# EAGLE schematic evlogger_voltage (EAGLE 6.5.0)
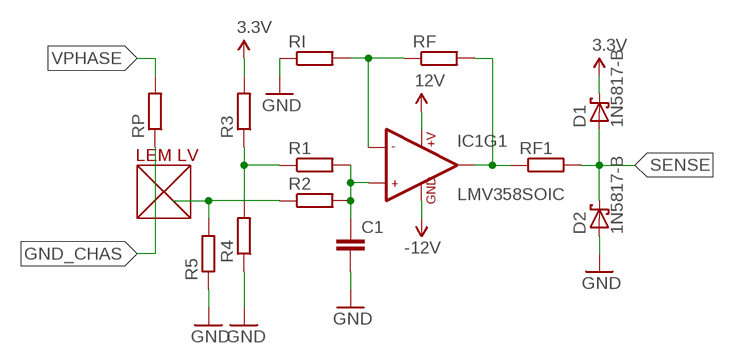
[diagram p0: schematic, sheet 1]

## Parts
C1  C-EU025-024X044  [C025-024X044]
D1  1N5817-B  [DO41-7.6]
D2  1N5817-B  [DO41-7.6]
IC1  LMV358SOIC  [SO08]
R1  R-EU_0207/10  [0207/10]
R2  R-EU_0207/10  [0207/10]
R3  R-EU_0207/10  [0207/10]
R4  R-EU_0207/10  [0207/10]
R5  R-EU_0207/10  [0207/10]
RF  R-EU_0207/10  [0207/10]
RF1  R-EU_0207/10  [0207/10]
RI  R-EU_0207/10  [0207/10]
RP  R-EU_0207/10  [0207/10]

## Nets
3.3V: D1.C R3.2
GND: C1.2 D2.A R4.1 R5.1 RI.1
GND_CHAS: RP.1
N$2: IC1.2(-IN1) RF.1 RI.2
N$4: C1.1 IC1.3(+IN1) R1.2 R2.2
N$5: R1.1 R3.1 R4.2
N$6: R2.1 R5.2
SENS: IC1.1(OUT1) RF1.1 RF.2
SENSE: D1.A D2.C RF1.2
VCC: IC1.8(+V) ; supply symbol labelled 12V
VNEG: IC1.4(GND) ; supply symbol labelled -12V
VPHASE: RP.2
Unconnected: IC1.5(+IN2) IC1.6(-IN2) IC1.7(OUT2)

## Notes on the sheet
- LEM LV

## Library data of the parts
C1 = rcl:C-EU: CAPACITOR, European symbol
D1 D2 = diode:1N581*: 1.0A SCHOTTKY BARRIER RECTIFIER Source: http://www.diodes.com/datasheets/ds23001.pdf
IC1 = SparkFun-AnalogIC:LMV358: Jellybean rail-to-rail output op-amp; PROD_ID: IC-09657
R1-R5 RF RF1 RI RP = rcl:R-EU_: RESISTOR, European symbol